# EAGLE design MineSweepers2019-Communcation (EAGLE 9.3.0)
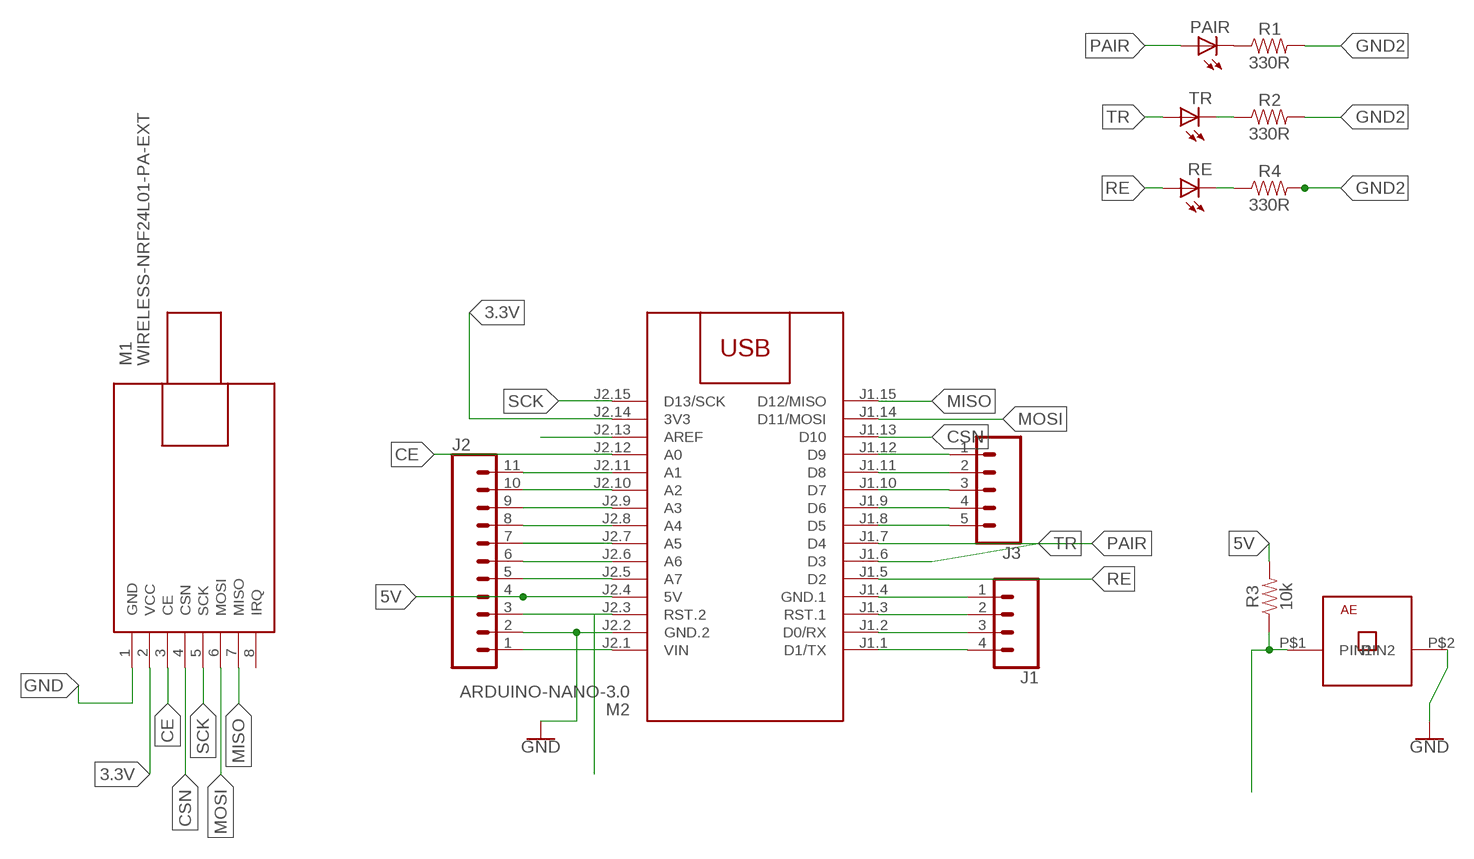
[diagram p0: schematic, sheet 1]

## Parts
J1  CONN_04  [1X04]
J2  CONN_11  [1X11]
J3  CONN_05  [1X05]
M1  WIRELESS-NRF24L01-PA-EXT  [WIRELESS-NRF24L01-PA-EXT]
M2  ARDUINO-NANO-3.0  [ARDUINO-NANO-3.0]
PAIR  LED3MM  [LED3MM]
R1  330R  10MOHM-HORIZ-1/4W-5%  [AXIAL-0.3]
R2  330R  10MOHM-HORIZ-1/4W-5%  [AXIAL-0.3]
R3  10k  10MOHM-HORIZ-1/4W-5%  [AXIAL-0.3]
R4  330R  10MOHM-HORIZ-1/4W-5%  [AXIAL-0.3]
RE  LED3MM  [LED3MM]
TR  LED3MM  [LED3MM]
U$1  PUSHBUTTON-AE  [PUSHBUTTON-AE]

## Nets
3.3V: M1.2(VCC) M2.J2.14(3V3)
5V: J2.4 M2.J2.4(5V) R3.P$2
CE: M1.3(CE) M2.J2.12(A0)
CSN: M1.4(CSN) M2.J1.13(D10)
GND: J2.2 M1.1(GND) M2.J2.2(GND.2) U$1.P$2(PIN2)
GND2: J1.1 M2.J1.4(GND.1) R1.P$2 R2.P$2 R4.P$2
MISO: M1.7(MISO) M2.J1.15(D12/MISO)
MOSI: M1.6(MOSI) M2.J1.14(D11/MOSI)
N$1: J1.2 M2.J1.3(RST.1)
N$2: J3.3 M2.J1.10(D7)
N$3: J3.2 M2.J1.11(D8)
N$4: J3.1 M2.J1.12(D9)
N$5: PAIR.K(C) R1.P$1
N$6: M2.J2.13(AREF)
N$7: R2.P$1 TR.K(C)
N$8: J2.11 M2.J2.11(A1)
N$9: J2.10 M2.J2.10(A2)
N$10: J2.9 M2.J2.9(A3)
N$11: J2.8 M2.J2.8(A4)
N$12: J2.7 M2.J2.7(A5)
N$13: J2.6 M2.J2.6(A6)
N$14: J2.5 M2.J2.5(A7)
N$15: R4.P$1 RE.K(C)
N$16: J2.3 M2.J2.3(RST.2)
N$17: J3.4 M2.J1.9(D6)
N$18: J2.1 M2.J2.1(VIN)
N$19: J3.5 M2.J1.8(D5)
N$25: J1.3 M2.J1.2(D0/RX)
N$26: J1.4 M2.J1.1(D1/TX)
N$50: R3.P$1 U$1.P$1(PIN1)
PAIR: M2.J1.7(D4) PAIR.A
RE: M2.J1.5(D2) RE.A
SCK: M1.5(SCK) M2.J2.15(D13/SCK)
TR: M2.J1.6(D3) TR.A
Unconnected: M1.8(IRQ)

## Library data of the parts
J1 = SparkFun-Connectors:CONN_04: Multi connection point. Often used as Generic Header-pin footprint for 0.1 inch spaced/style header connections On any of the 0.1 inch spaced packages, you can populate with these: Break Away Headers - Straight <https://www.sparkfun.com/products/116> (PRT-00116) Break Away Male Headers - Right Angle <https://www.sparkfun.com/products/553> (PRT-00553) Female Headers <https://www.sparkfun.com/products/115> (PRT-00115) Break Away Headers - Machine Pin <https://www.sparkfun.com/products/117> (PRT-00117) Break Away Female Headers - Swiss Machine Pin <https://www.sparkfun.com/products/743> (PRT-00743) For SCREWTERMINALS and SPRING TERMINALS visit here: Screw Terimnals on SparkFun.com <https://www.sparkfun.com/search/results?term=Screw+Terminals> (5mm/3.5mm/2.54mm spacing) This device is also useful as a general connection point to wire up your design to another part of your project. Our various solder wires solder well into these plated through hole pads. Hook-Up Wire - Assortment (Stranded, 22 AWG) <https://www.sparkfun.com/products/11375> (PRT-11375) Hook-Up Wire - Assortment (Solid Core, 22 AWG) <https://www.sparkfun.com/products/11367> (PRT-11367) View the entire wire category on our website here <https://www.sparkfun.com/categories/141> Special notes: Molex polarized connector foot print use with SKU : PRT-08231 with associated crimp pins and housings. 1MM SMD Version SKU: PRT-10208; PROD_ID: CONN-09696
J2 = SparkFun-Connectors:CONN_11: Multi connection point. Often used as Generic Header-pin footprint for 0.1 inch spaced/style header connections On any of the 0.1 inch spaced packages, you can populate with these: Break Away Headers - Straight <https://www.sparkfun.com/products/116> (PRT-00116) Break Away Male Headers - Right Angle <https://www.sparkfun.com/products/553> (PRT-00553) Female Headers <https://www.sparkfun.com/products/115> (PRT-00115) Break Away Headers - Machine Pin <https://www.sparkfun.com/products/117> (PRT-00117) Break Away Female Headers - Swiss Machine Pin <https://www.sparkfun.com/products/743> (PRT-00743) For SCREWTERMINALS and SPRING TERMINALS visit here: Screw Terimnals on SparkFun.com <https://www.sparkfun.com/search/results?term=Screw+Terminals> (5mm/3.5mm/2.54mm spacing) This device is also useful as a general connection point to wire up your design to another part of your project. Our various solder wires solder well into these plated through hole pads. Hook-Up Wire - Assortment (Stranded, 22 AWG) <https://www.sparkfun.com/products/11375> (PRT-11375) Hook-Up Wire - Assortment (Solid Core, 22 AWG) <https://www.sparkfun.com/products/11367> (PRT-11367) View the entire wire category on our website here <https://www.sparkfun.com/categories/141>
J3 = SparkFun-Connectors:CONN_05: Multi connection point. Often used as Generic Header-pin footprint for 0.1 inch spaced/style header connections On any of the 0.1 inch spaced packages, you can populate with these: Break Away Headers - Straight <https://www.sparkfun.com/products/116> (PRT-00116) Break Away Male Headers - Right Angle <https://www.sparkfun.com/products/553> (PRT-00553) Female Headers <https://www.sparkfun.com/products/115> (PRT-00115) Break Away Headers - Machine Pin <https://www.sparkfun.com/products/117> (PRT-00117) Break Away Female Headers - Swiss Machine Pin <https://www.sparkfun.com/products/743> (PRT-00743) For SCREWTERMINALS and SPRING TERMINALS visit here: Screw Terimnals on SparkFun.com <https://www.sparkfun.com/search/results?term=Screw+Terminals> (5mm/3.5mm/2.54mm spacing) This device is also useful as a general connection point to wire up your design to another part of your project. Our various solder wires solder well into these plated through hole pads. Hook-Up Wire - Assortment (Stranded, 22 AWG) <https://www.sparkfun.com/products/11375> (PRT-11375) Hook-Up Wire - Assortment (Solid Core, 22 AWG) <https://www.sparkfun.com/products/11367> (PRT-11367) View the entire wire category on our website here <https://www.sparkfun.com/categories/141> Special notes: Molex polarized connector foot print use with SKU : PRT-08231 with associated crimp pins and housings. 1MM SMD Version SKU: PRT-10208
M1 = diy-modules:WIRELESS-NRF24L01-PA-EXT: 2.4 GHz Wireless Module based on NRF24L01 chip with preamplifier and external antenna Click here to find device on ebay.com <http://www.ebay.com/sch/nrf24l01+pa+lna+sma>
M2 = diy-modules:ARDUINO-NANO-3.0: Arduino Nano 3.0 and compatible devices More details available here: https://www.arduino.cc/en/Main/ArduinoBoardNano Click here to find device on ebay.com <http://www.ebay.com/sch/arduino+nano>
PAIR RE TR = led:LED: LED OSRAM: - CHIPLED LG R971, LG N971, LY N971, LG Q971, LY Q971, LO R971, LY R971 LH N974, LH R974 LS Q976, LO Q976, LY Q976 LO Q996 - Hyper CHIPLED LW Q18S LB Q993, LB Q99A, LB R99A - SideLED LS A670, LO A670, LY A670, LG A670, LP A670 LB A673, LV A673, LT A673, LW A673 LH A674 LY A675 LS A676, LA A676, LO A676, LY A676, LW A676 LS A679, LY A679, LG A679 - Hyper Micro SIDELED® LS Y876, LA Y876, LO Y876, LY Y876 LT Y87S - SmartLED LW L88C, LW L88S LB L89C, LB L89S, LG L890 LS L89K, LO L89K, LY L89K LS L896, LA L896, LO L896, LY L896 - TOPLED LS T670, LO T670, LY T670, LG T670, LP T670 LSG T670, LSP T670, LSY T670, LOP T670, LYG T670 LG T671, LOG T671, LSG T671 LB T673, LV T673, LT T673, LW T673 LH T674 LS T676, LA T676, LO T676, LY T676, LB T676, LH T676, LSB T676, LW T676 LB T67C, LV T67C, LT T67C, LS T67K, LO T67K, LY T67K, LW E67C LS E67B, LA E67B, LO E67B, LY E67B, LB E67C, LV E67C, LT E67C LW T67C LS T679, LY T679, LG T679 LS T770, LO T770, LY T770, LG T770, LP T770 LB T773, LV T773, LT T773, LW T773 LH T774 LS E675, LA E675, LY E675, LS T675 LS T776, LA T776, LO T776, LY T776, LB T776 LHGB T686 LT T68C, LB T68C - Hyper Mini TOPLED® LB M676 - Mini TOPLED Santana® LG M470 LS M47K, LO M47K, LY M47K Source: http://www.osram.convergy.de LUXEON: - LUMILED® LXK2-PW12-R00, LXK2-PW12-S00, LXK2-PW14-U00, LXK2-PW14-V00 LXK2-PM12-R00, LXK2-PM12-S00, LXK2-PM14-U00 LXK2-PE12-Q00, LXK2-PE12-R00, LXK2-PE12-S00, LXK2-PE14-T00, LXK2-PE14-U00 LXK2-PB12-K00, LXK2-PB12-L00, LXK2-PB12-M00, LXK2-PB14-N00, LXK2-PB14-P00, LXK2-PB14-Q00 LXK2-PR12-L00, LXK2-PR12-M00, LXK2-PR14-Q00, LXK2-PR14-R00 LXK2-PD12-Q00, LXK2-PD12-R00, LXK2-PD12-S00 LXK2-PH12-R00, LXK2-PH12-S00 LXK2-PL12-P00, LXK2-PL12-Q00, LXK2-PL12-R00 Source: www.luxeon.com KINGBRIGHT: KA-3528ASYC Source: www.kingbright.com
R1-R4 = SparkFun-Resistors:10MOHM: RES-09327; PROD_ID: RES-09327; VALUE: 10M
U$1 = PushButton-AE:PUSHBUTTON-AE: This is 2 pin push button designed by the one and only Alaa Essam وماعندناش داتا شيت ان كان عاجبك

## Board
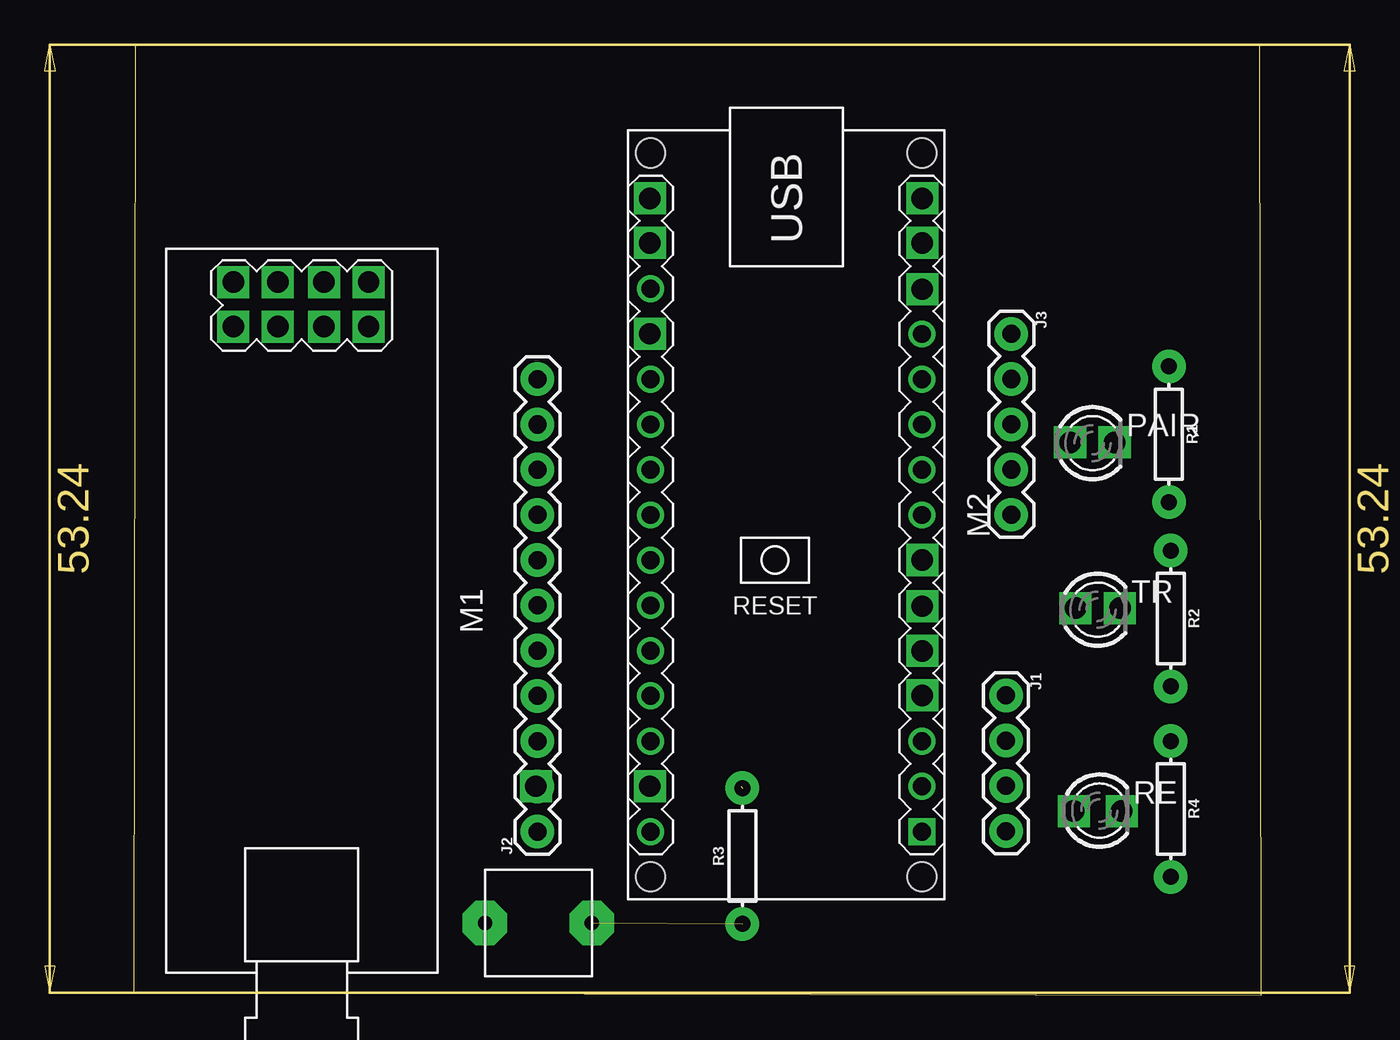
[diagram p1: board, top side]
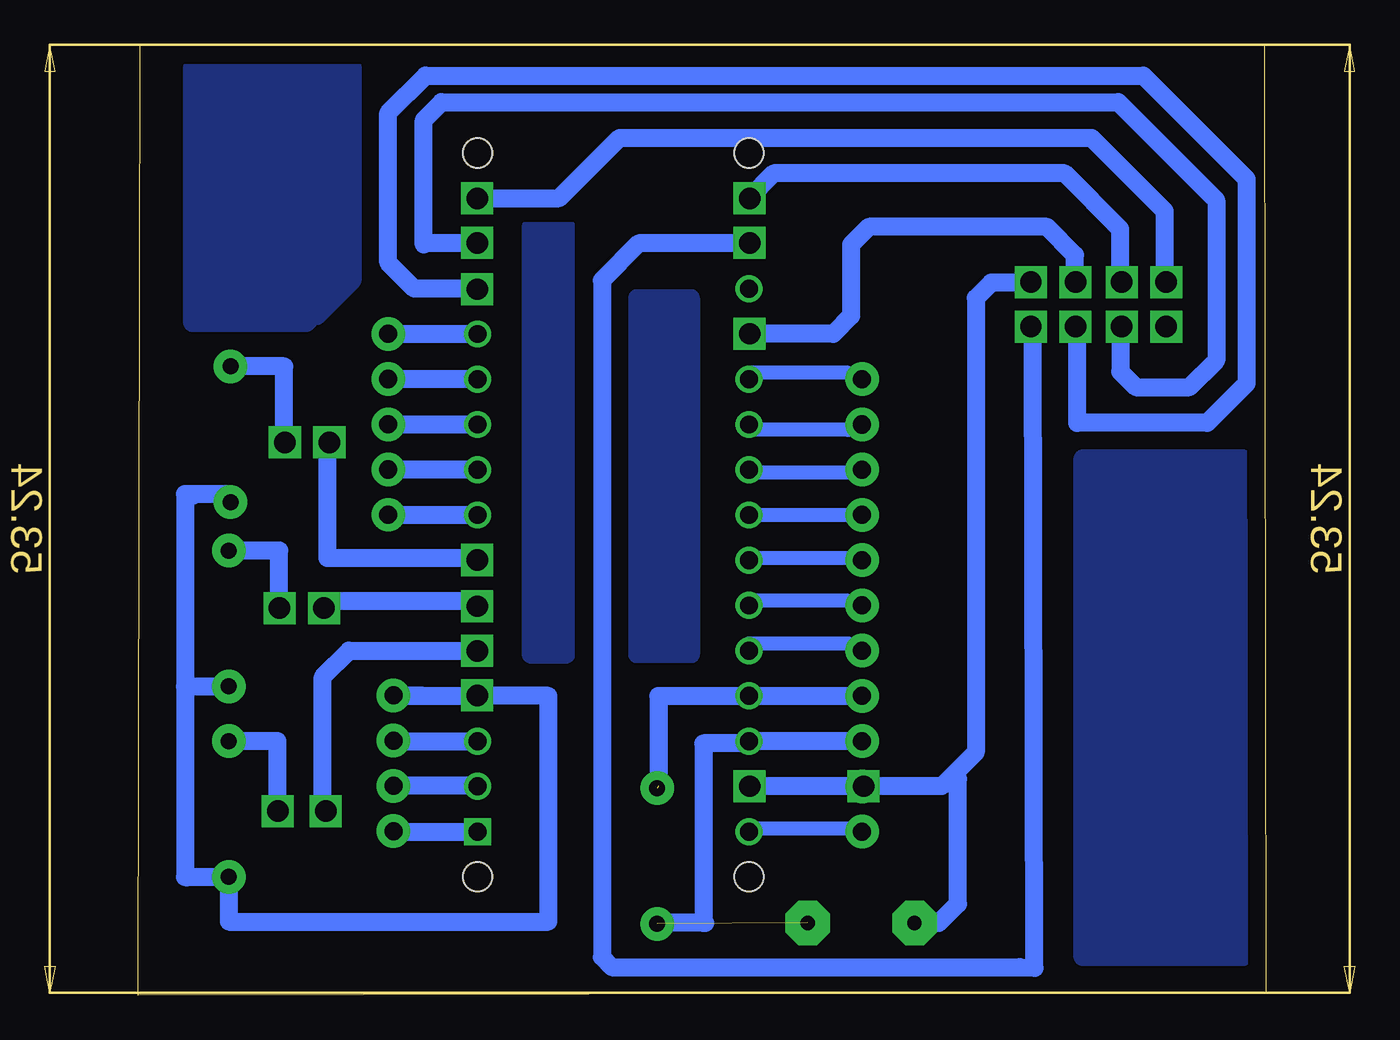
[diagram p2: board, bottom side, seen from below]

Size 63.35 x 53.37 mm. Coordinates in mm from the lower left corner, seen from the top.
Outline: 0,0.13 63.35,0 63.24,53.37 0.09,53.37 0,0.13
Copper layers (1*16): Top 0.035mm / dielectric 1.5mm / Bottom 0.035mm
Design rules "default *": minimum track width 0.8mm, minimum drill 0.35mm, track to track 0.8mm, track to pad 0.8mm, pad to pad 6mil, via to via 6mil, smd to smd 6mil, copper to edge 40mil, drill to drill 6mil, minimum pad ring 10mil, minimum via ring 8mil, stop-mask expansion 4mil, vias tented up to drill 0mil, thermal gap 10mil

### Footprints (pad centres in the part's own frame; a part is rotated, then mirrored left to right if it is on the bottom)
1X04 = drill 1.016 pad 1.88: 1 0,0; 2 2.54,0; 3 5.08,0; 4 7.62,0
1X11 = drill 1.016 pad 1.88: 1 0,0; 2 2.54,0; 3 5.08,0; 4 7.62,0; 5 10.16,0; 6 12.7,0; 7 15.24,0; 8 17.78,0; 9 20.32,0; 10 22.86,0; 11 25.4,0
1X05 = drill 1.016 pad 1.88: 1 0,0; 2 2.54,0; 3 5.08,0; 4 7.62,0; 5 10.16,0
WIRELESS-NRF24L01-PA-EXT = drill 1 square: 1 -18.415,3.81 | drill 1: 2 -15.875,3.81; 3 -18.415,1.27; 4 -15.875,1.27; 5 -18.415,-1.27; 6 -15.875,-1.27; 7 -18.415,-3.81; 8 -15.875,-3.81
ARDUINO-NANO-3.0 = drill 1 square: J1.1 17.78,7.62 | drill 1: J1.2 15.24,7.62; J1.3 12.7,7.62; J1.4 10.16,7.62; J1.5 7.62,7.62; J1.6 5.08,7.62; J1.7 2.54,7.62; J1.8 0,7.62; J1.9 -2.54,7.62; J1.10 -5.08,7.62; J1.11 -7.62,7.62; J1.12 -10.16,7.62; J1.13 -12.7,7.62; J1.14 -15.24,7.62; J1.15 -17.78,7.62; J2.1 17.78,-7.62; J2.2 15.24,-7.62; J2.3 12.7,-7.62; J2.4 10.16,-7.62; J2.5 7.62,-7.62; J2.6 5.08,-7.62; J2.7 2.54,-7.62; J2.8 0,-7.62; J2.9 -2.54,-7.62; J2.10 -5.08,-7.62; J2.11 -7.62,-7.62; J2.12 -10.16,-7.62; J2.13 -12.7,-7.62; J2.14 -15.24,-7.62; J2.15 -17.78,-7.62 | hole 1.651: -20.32,7.62; -20.32,-7.62; 20.32,-7.62; 20.32,7.62
LED3MM = drill 0.813 octagon: A -1.27,0; K 1.27,0
AXIAL-0.3 = drill 0.9 pad 1.88: P$1 -3.81,0; P$2 3.81,0
PUSHBUTTON-AE = drill 0.8 pad 2.5 octagon: P$1 -3,0; P$2 -3,-6

### Placement (x,y rotation side)
J1  49,16.83 270 top
J2  22.69,9.18 90 top
J3  49.3,37.13 270 top
M1  9.45,21.58 270 top
M2  36.66,26.96 270 top
PAIR  53.86,30.99 0 top
R1  58.15,31.49 270 top
R2  58.25,21.15 270 top
R3  34.19,7.81 90 top
R4  58.25,10.45 270 top
RE  54.24,10.36 0 top
TR  54.14,21.64 0 top
U$1  25.74,1.05 270 top

### Tracks (layer width: path | path; a pad name or v marks a point on that pad's centre or on a via)
3.3V
  Bottom 1: M2.J2.14 35.23,42.2 37.3,40.13 37.3,2.13 36.74,1.57 13.84,1.57 13,1.53 13.1,37.29 M1.2
5V  (1 unrouted)
  Bottom 1: 34.12,11.72 34.12,16.8 M2.J2.4 J2.4
CE  (via drill 1.2)
  Bottom 1: M1.3 10.72,41.55 12.3,43.13 22.3,43.13 23.3,42.13 23.3,38.13 24.3,37.13 v29,37.13 M2.J2.12
CSN
  Bottom 1: M2.J1.13 47.83,39.66 49.3,41.13 49.3,49.53 47.2,51.63 6.9,51.63 1.1,45.83 1.1,34.33 3.3,32.13 10.6,32.13 10.6,37.33 M1.4
GND  (via drill 1.2)
  Bottom 1: M2.J2.2 J2.2 v22.6,11.73 18.2,11.73 17.55,12.38 | M1.1 15.43,40 16.3,39.13 16.3,13.63 17.55,12.38 | U$1.P$2 18.38,4.05 17.3,5.13 17.3,12.13 17.55,12.38
GND2
  Bottom 1: R1.P$2 58.15,28.13 60.3,28.13 60.3,28.03 60.4,28.03 60.4,28.13 60.7,28.13 60.7,17.34 | 60.7,17.34 R2.P$2 | 60.7,17.34 60.7,6.63 60.5,6.63 60.5,6.64 R4.P$2 58.25,4.13 40.3,4.13 40.3,16.8 M2.J1.4 47.3,16.8 | 47.3,16.8 49.3,16.8 | J1.1 49,16.8 47.3,16.8
MISO
  Bottom 1: M2.J1.15 39.69,44.74 36.3,48.13 9.8,48.13 5.7,44.03 5.7,40.05 M1.7
MOSI
  Bottom 1: M2.J1.14 47.23,42.2 47.3,42.13 47.3,49.13 46.3,50.13 8.3,50.13 2.8,44.63 2.8,35.63 4.3,34.13 7.3,34.13 8.18,35.01 M1.6
N$1
  Bottom 1: J1.2 49,14.26 M2.J1.3
N$2
  Bottom 1: 49.3,32.13 J3.3 M2.J1.10
N$3
  Bottom 0.8: 44.26,34.93 M2.J1.11
  Bottom 1: M2.J1.11 J3.2
N$4
  Bottom 1: J3.1 M2.J1.12
N$5
  Bottom 1: PAIR.K 55.13,35.3 R1.P$1
N$7
  Bottom 1: TR.K 55.41,24.96 R2.P$1
N$8
  Bottom 0.8: M2.J2.11 29.06,34.93 23.46,34.93 J2.11
N$9
  Bottom 0.8: M2.J2.10 29.06,31.73 23.46,31.73 J2.10
N$10
  Bottom 0.8: M2.J2.9 29.06,29.33 23.46,29.33 J2.9
N$11
  Bottom 0.8: M2.J2.8 29.06,26.93 23.46,26.93 J2.8
N$12
  Bottom 0.8: M2.J2.7 29.06,24.53 23.46,24.53 J2.7
N$13
  Bottom 0.8: M2.J2.6 29.06,22.13 23.46,22.13 J2.6
N$14
  Bottom 0.8: M2.J2.5 29.06,19.73 23.46,19.73 J2.5
N$15
  Bottom 1: RE.K 55.51,14.26 R4.P$1
N$16
  Bottom 1: J2.3 M2.J2.3 29.04,14.13 31.6,14.13 31.6,4.05 31.5,4.05 34.19,4.05
N$17
  Bottom 1: M2.J1.9 J3.4
N$18
  Bottom 0.8: M2.J2.1 29.06,9.33 23.46,9.33 J2.1
N$19
  Bottom 1: J3.5 M2.J1.8
N$20
  pour Bottom: 10.3,30.13 1.3,30.13 1.3,2.13 10.3,2.13
N$21
  pour Bottom: 32.3,39.13 32.3,19.13 35.3,19.13 35.3,39.13 33.3,39.13
N$22
  pour Bottom: 41.3,43.13 41.3,19.13 39.3,19.13 39.3,43.13
N$23
  pour Bottom: 51.3,52.13 51.3,40.13 53.3,38.13 53.5,38.13 53.9,37.73 60.3,37.73 60.3,42.13 60.3,52.13
N$24  (via drill 1.2)
  other vias: 5.6,40.03
N$25
  Bottom 1: M2.J1.2 44.28,11.75 J1.3
N$26
  Bottom 1: J1.4 49,9.18 M2.J1.1
N$27  (via drill 1.2)
  other vias: 8.1,40.03
N$28  (via drill 1.2)
  other vias: 10.7,40.03
N$29  (via drill 1.2)
  other vias: 13.2,40.03
N$30  (via drill 1.2)
  other vias: 13.2,37.53
N$31  (via drill 1.2)
  other vias: 10.7,37.53
N$32  (via drill 1.2)
  other vias: 8.1,37.53
N$33  (via drill 1.2)
  other vias: 5.6,37.53
N$34  (via drill 1.2)
  other vias: 29,44.73
N$35  (via drill 1.2)
  other vias: 29,42.23
N$36  (via drill 1.2)
  other vias: 44.3,44.73
N$37  (via drill 1.2)
  other vias: 44.3,42.23
N$38  (via drill 1.2)
  other vias: 44.3,39.63
N$39  (via drill 1.2)
  other vias: 44.3,24.43
N$40  (via drill 1.2)
  other vias: 44.3,21.83
N$41  (via drill 1.2)
  other vias: 44.3,19.33
N$42  (via drill 1.2)
  other vias: 44.3,16.83
N$43  (via drill 1.2)
  other vias: 29,11.73
N$44  (via drill 1.2)
  other vias: 52.6,31.03
N$45  (via drill 1.2)
  other vias: 55.1,31.03
N$46  (via drill 1.2)
  other vias: 55.4,21.73
N$47  (via drill 1.2)
  other vias: 52.9,21.73
N$48  (via drill 1.2)
  other vias: 55.5,10.33
N$49  (via drill 1.2)
  other vias: 52.8,10.33
N$50  (1 unrouted)
PAIR
  Bottom 1: PAIR.A 52.7,30.99 52.7,24.53 44.28,24.53 M2.J1.7
RE
  Bottom 1: RE.A 52.97,17.87 51.5,19.34 M2.J1.5
SCK
  Bottom 1: M1.5 8.18,43.01 11.3,46.13 27.65,46.13 M2.J2.15
TR
  Bottom 1: 52.77,21.88 TR.A 52.87,22.13 44.28,22.13 M2.J1.6